# Altium schematic sheet DAQ_Amp.SchDoc
size A4; SheetNumber: 1; SheetTotal: 1
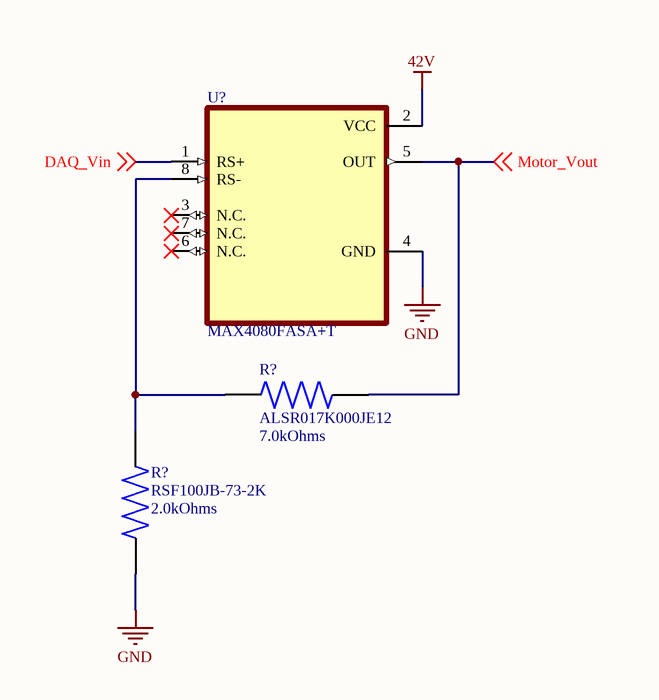
[diagram p0: DAQ_Amp.SchDoc]

## Parts
(Parts that share a designator on the sheet are numbered #1, #2 ... from top to bottom, then left to right.)
R?#1  ALSR017K000JE12  value 7.0kOhms  [Thru Hole Resistor]
R?#2  RSF100JB-73-2K  value 2.0kOhms  [Thru Hole Resistor]
U?  MAX4080FASA+T  [SOIC127P600X175-8N]

## Nets
42V: U?.2(VCC)
GND: R?#2.1 U?.4(GND)
DAQ_Vin: U?.1(RS+) ; off-sheet DAQ_Vin
Motor_Vout: R?#1.2 U?.5(OUT) ; off-sheet Motor_Vout
NetR?#1_1: R?#1.1 R?#2.2 U?.8(RS-)

Not connected (* = marked no-connect by the designer): U? 3(N.C.)* 6(N.C.)* 7(N.C.)*

## Library data of the parts
R?#1 = ALSR017K000JE12: 7 kOhms ±5% 1W Through Hole Resistor Axial Moisture Resistant Wirewound; Seller Part Number: ALSR1J-7.0K-ND; Manufacturer: Vishay Dale; Manufacturer Product Number: ALSR017K000JE12
R?#2 = RSF100JB-73-2K: 2 kOhms ±5% 1W Through Hole Resistor Axial Flame Proof, Safety Metal Oxide Film; Seller Part Number: 2.0KW-1-ND; Manufacturer: YAGEO; Manufacturer Product Number: RSF100JB-73-2K
U? = MAX4080FASA+T: Current Sense Amplifier 1 Circuit - 8-SOIC; MF: Maxim Integrated; Availability: In Stock; SnapEDA_Link: https://www.snapeda.com/parts/MAX4080FASA+T/Maxim+Integrated/view-part/?ref=snap; Check_prices: https://www.snapeda.com/parts/MAX4080FASA+T/Maxim+Integrated/view-part/?ref=eda; Price: None; Value: *; Package: SOIC-8 Maxim; Purchase-URL: https://pricing.snapeda.com/search/part/MAX4080FASA+T/?ref=eda; MP: MAX4080FASA+T